# Altium schematic sheet -20_to_-12.SchDoc
size A; SheetNumber: 3; SheetTotal: 6
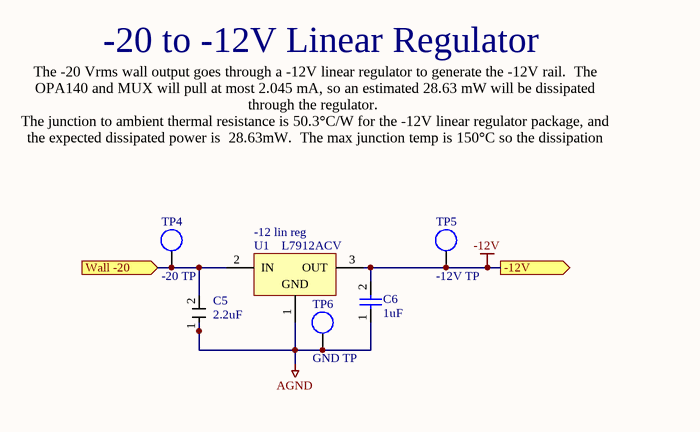
[diagram p0: -20_to_-12.SchDoc]

## Parts
C5  2.2uF  [CAPMP3216X180N]
C6  1uF  [CAPC2113X120X50LL20T30]
TP4  -20 TP  [PCBComponent_1]
TP5  -12V TP  [PCBComponent_1]
TP6  GND TP  [PCBComponent_1]
U1  L7912ACV  [TO220]

## Ports
-12V (out), Wall -20 (in)

## Nets
-12V: C6.2 TP5.TP U1.3(OUT) ; port -12V
AGND: C5.1(-) C6.1 TP6.TP U1.1(GND)
Wall -20: C5.2(-) TP4.TP U1.2(IN) ; port Wall -20

## Notes on the sheet
- -20 to -12V Linear Regulator
- The -20 Vrms wall output goes through a -12V linear regulator to generate the -12V rail.  The OPA140 and MUX will pull at most 2.045 mA, so an estimated 28.63 mW will be dissipated through the regulator.
  The junction to ambient thermal resistance is 50.3°C/W for the -12V linear regulator package, and the expected dissipated power is  28.63mW.  The max junction temp is 150°C so the dissipation will cause 1.44°C, acceptable for the IC.
- (near U1) -12 lin reg

## Library data of the parts
C5 = CMP-001-00083-1: Cap Tant Solid 2.2uF 35V A CASE 10% (3.2 X 1.6 X 1.6mm) SMD 3216-18 7Ohm 125°C T/R; Pin 1 is +, Pin 2 is -
C6 = CMP-2007-04033-1: Manufacturer: AVX Interconnect / Elco; Part Number: TAJR105K020RNJ
TP4-TP6 = Component_1
U1 = CMP-0244-00427-1: 2% Negative Voltage Regulator, -12V, 3-Pin TO-220; ComponentLink2Description: Datasheet; PackageReference: TO220; ComponentLink1Description: Manufacturer URL; DatasheetVersion: 1/11/2010; ComponentLink2URL: http://www.st.com/internet/com/TECHNICAL_RESOURCES/TECHNICAL_LITERATURE/DATASHEET/CD00000451.pdf; PackageVersion: ver3.0; ComponentLink3Description: Package Specification; PackageDescription: TO, Thru-Hole, Vertical, Heatsink Mounted; 3 In-Line Leads; Pitch 2.54 mm; ComponentLink3URL: http://www.st.com/internet/com/TECHNICAL_RESOURCES/TECHNICAL_LITERATURE/PACKAGE_INFORMATION/CD00004649.pdf; ComponentLink1URL: http://www.st.com